# EAGLE design neo (EAGLE 7.6.0)

## Sheet 1 of 2
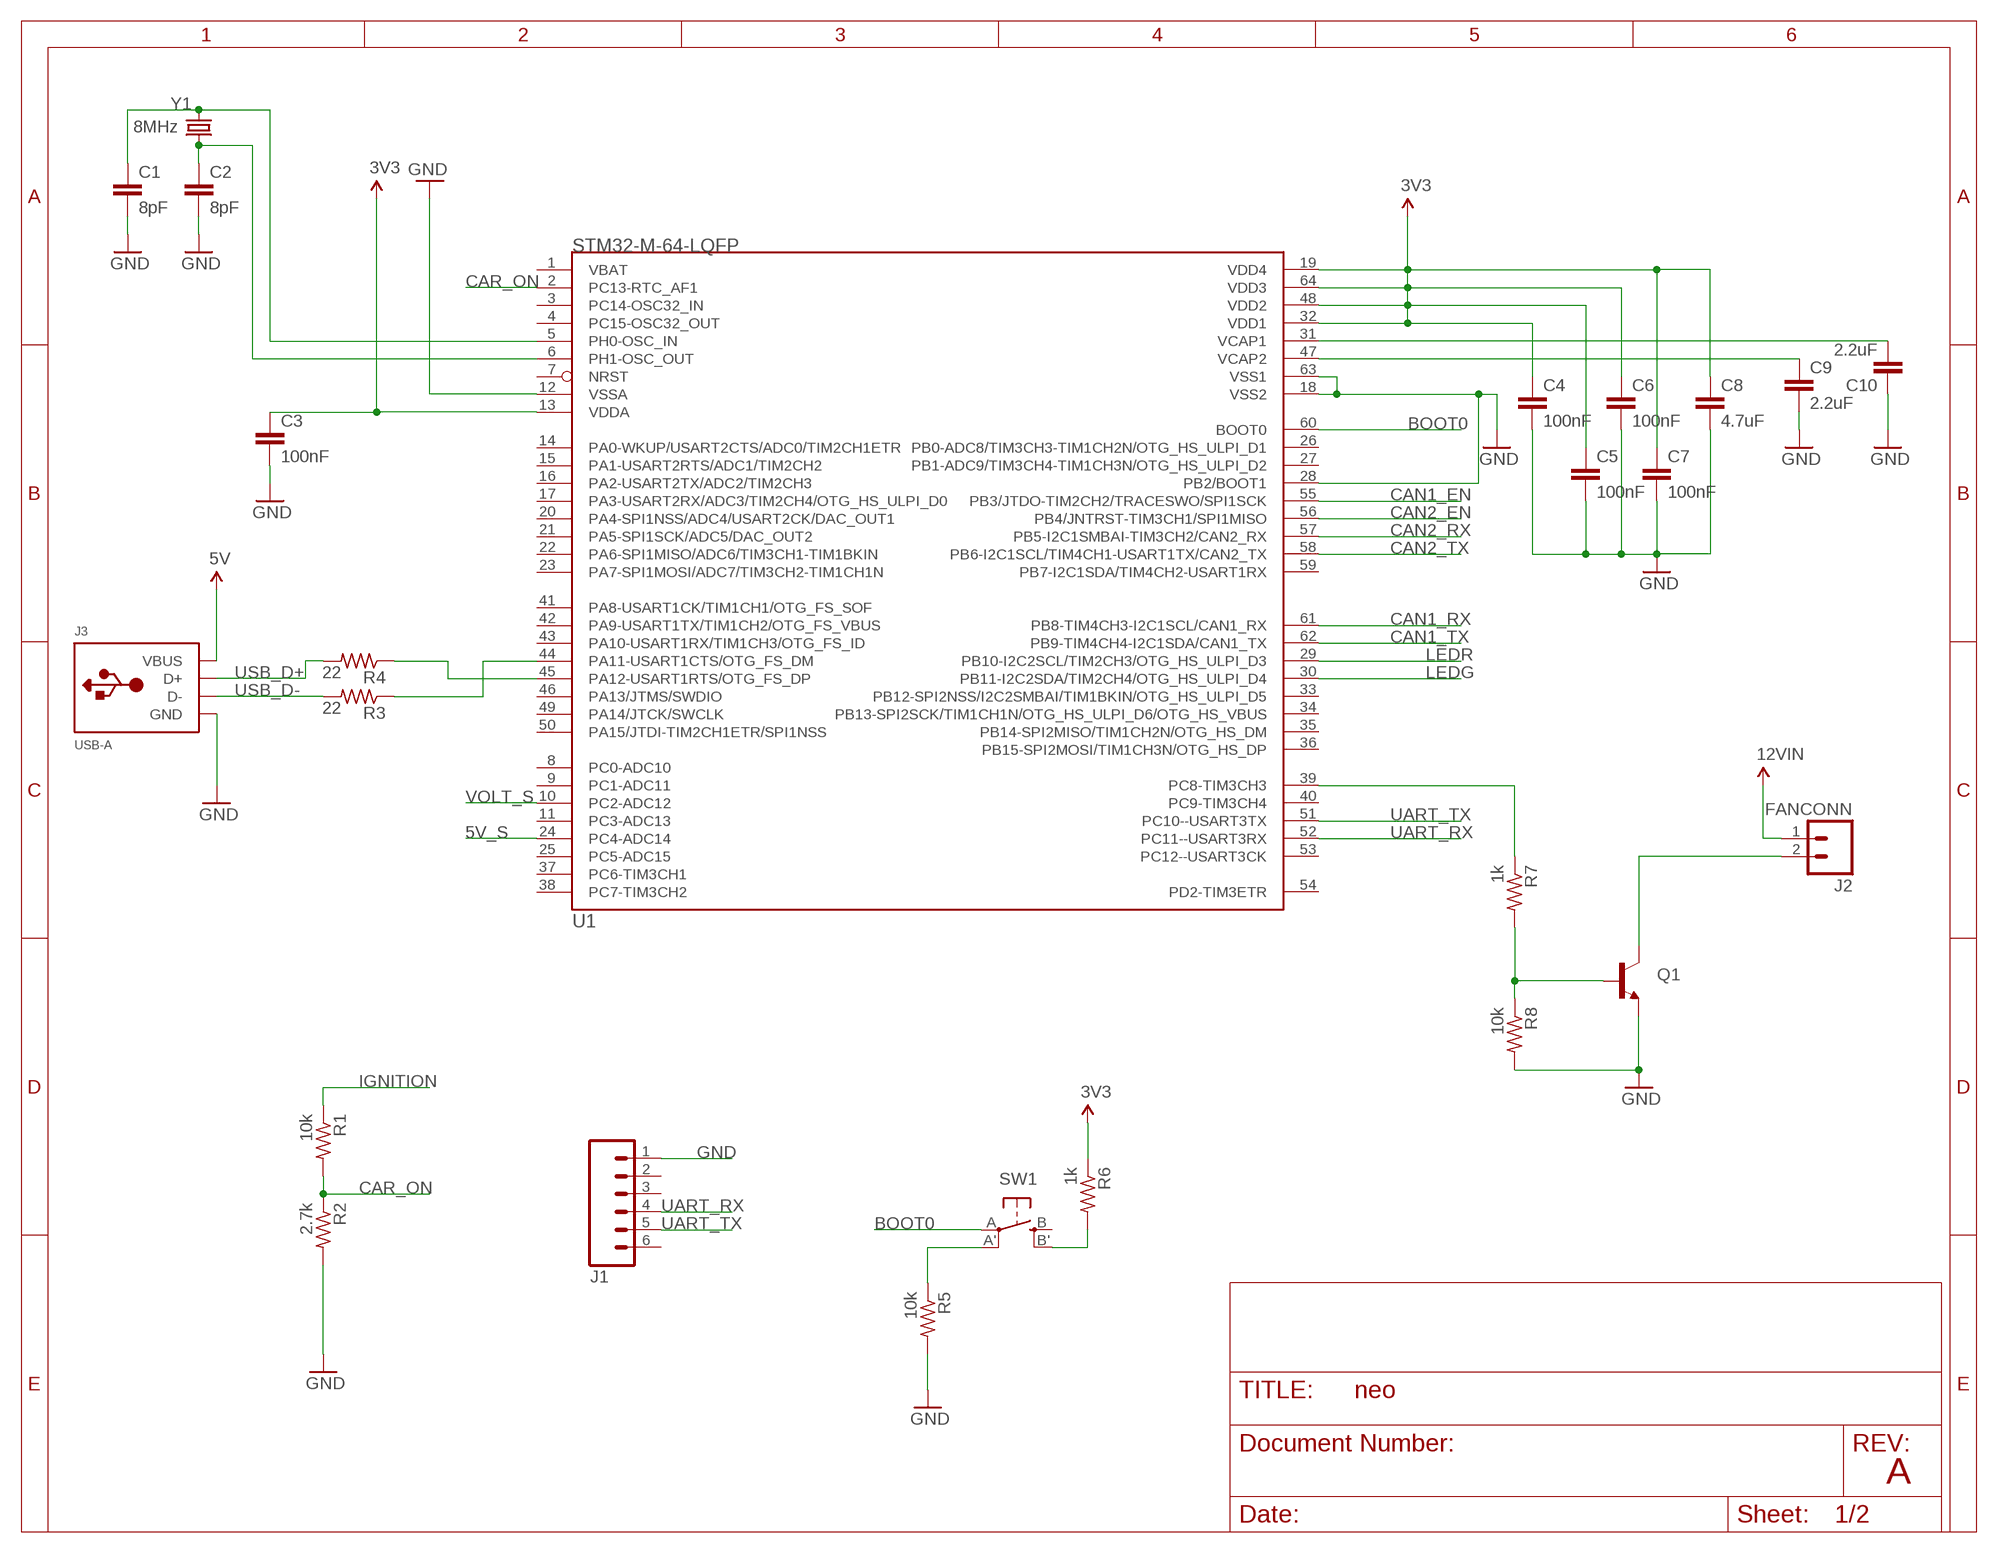
[diagram p0: schematic, sheet 1]

### Parts
C1  8pF  1.0UF-16V-10%(0603)  [0603-CAP]
C2  8pF  1.0UF-16V-10%(0603)  [0603-CAP]
C3  100nF  1.0UF-16V-10%(0603)  [0603-CAP]
C4  100nF  1.0UF-16V-10%(0603)  [0603-CAP]
C5  100nF  1.0UF-16V-10%(0603)  [0603-CAP]
C6  100nF  0.1UF-25V-5%(0603)  [0603-CAP]
C7  100nF  1.0UF-16V-10%(0603)  [0603-CAP]
C8  4.7uF  1.0UF-16V-10%(0603)  [0603-CAP]
C9  2.2uF  1.0UF-16V-10%(0603)  [0603-CAP]
C10  2.2uF  1.0UF-16V-10%(0603)  [0603-CAP]
J1  M06NO_SILK_YES_STOP  [1X06_NO_SILK_YES_STOP]
J2  FANCONN  [1.25CONN]
J3  USB-A  [MOLEX_480371000]
Q1  MMBT2222A  TRANSISTOR_NPNMMBT2222A  [SOT23-3]
R1  10k  R-US_R0603  [R0603]
R2  2.7k  R-US_R0603  [R0603]
R3  22  R-US_R0603  [R0603]
R4  22  R-US_R0603  [R0603]
R5  10k  R-US_R0603  [R0603]
R6  1k  R-US_R0603  [R0603]
R7  1k  R-US_R0603  [R0603]
R8  10k  R-US_R0603  [R0603]
SW1  SPST_TACT-EVQQ2  [EVQ-Q2]
U1  STM32-M-64-LQFP  [LQFP64]
Y1  8MHz  CRYSTALTXC-7A  [CRYSTAL-TXC-7A]

### Nets
3V3: C3.1 C4.1 C5.1 C6.1 C7.1 C8.1 R6.1 U1.13(VDDA) U1.19(VDD4) U1.32(VDD1) U1.48(VDD2) U1.64(VDD3) ; also sheet 2
5V: J3.1(VBUS) ; also sheet 2
5V_S: U1.24(PC4-ADC14) ; also sheet 2
12VIN: J2.1 ; also sheet 2
BOOT0: SW1.A(P) U1.60(BOOT0)
CAN1_EN: U1.55(PB3/JTDO-TIM2CH2/TRACESWO/SPI1SCK) ; also sheet 2
CAN1_RX: U1.61(PB8-TIM4CH3-I2C1SCL/CAN1_RX) ; also sheet 2
CAN1_TX: U1.62(PB9-TIM4CH4-I2C1SDA/CAN1_TX) ; also sheet 2
CAN2_EN: U1.56(PB4/JNTRST-TIM3CH1/SPI1MISO) ; also sheet 2
CAN2_RX: U1.57(PB5-I2C1SMBAI-TIM3CH2/CAN2_RX) ; also sheet 2
CAN2_TX: U1.58(PB6-I2C1SCL/TIM4CH1-USART1TX/CAN2_TX) ; also sheet 2
CAR_ON: R1.2 R2.1 U1.2(PC13-RTC_AF1)
FAN_PWM: R7.1 U1.39(PC8-TIM3CH3)
GND: C1.2 C2.2 C3.2 C4.2 C5.2 C6.2 C7.2 C8.2 C9.2 C10.1 J1.1 J3.4(GND) Q1.2(E) R2.2 R5.2 R8.2 U1.12(VSSA) U1.18(VSS2) U1.28(PB2/BOOT1) U1.63(VSS1) ; also sheet 2
IGNITION: R1.1 ; also sheet 2
LEDG: U1.30(PB11-I2C2SDA/TIM2CH4/OTG_HS_ULPI_D4) ; also sheet 2
LEDR: U1.29(PB10-I2C2SCL/TIM2CH3/OTG_HS_ULPI_D3) ; also sheet 2
N$1: C1.1 U1.5(PH0-OSC_IN) Y1.P$1
N$3: C2.1 U1.6(PH1-OSC_OUT) Y1.P$2
N$5: R4.1 U1.45(PA12-USART1RTS/OTG_FS_DP)
N$6: J2.2 Q1.3(C)
N$7: Q1.1(B) R7.2 R8.1
N$8: R5.1 SW1.A'(P1)
N$14: R6.2 SW1.B'(S1)
N$35: R3.1 U1.44(PA11-USART1CTS/OTG_FS_DM)
UART_RX: J1.4 U1.52(PC11--USART3RX)
UART_TX: J1.5 U1.51(PC10--USART3TX)
USB_D+: J3.3(D+) R4.2
USB_D-: J3.2(D-) R3.2
VCAP1: C10.2 U1.31(VCAP1)
VCAP2: C9.1 U1.47(VCAP2)
VOLT_S: U1.10(PC2-ADC12) ; also sheet 2
Unconnected: J1.2 J1.3 J1.6 SW1.B(S) U1.1(VBAT) U1.3(PC14-OSC32_IN) U1.4(PC15-OSC32_OUT) U1.7(NRST) U1.8(PC0-ADC10) U1.9(PC1-ADC11) U1.11(PC3-ADC13) U1.14(PA0-WKUP/USART2CTS/ADC0/TIM2CH1ETR) U1.15(PA1-USART2RTS/ADC1/TIM2CH2) U1.16(PA2-USART2TX/ADC2/TIM2CH3) U1.17(PA3-USART2RX/ADC3/TIM2CH4/OTG_HS_ULPI_D0) U1.20(PA4-SPI1NSS/ADC4/USART2CK/DAC_OUT1) U1.21(PA5-SPI1SCK/ADC5/DAC_OUT2) U1.22(PA6-SPI1MISO/ADC6/TIM3CH1-TIM1BKIN) U1.23(PA7-SPI1MOSI/ADC7/TIM3CH2-TIM1CH1N) U1.25(PC5-ADC15) U1.26(PB0-ADC8/TIM3CH3-TIM1CH2N/OTG_HS_ULPI_D1) U1.27(PB1-ADC9/TIM3CH4-TIM1CH3N/OTG_HS_ULPI_D2) U1.33(PB12-SPI2NSS/I2C2SMBAI/TIM1BKIN/OTG_HS_ULPI_D5) U1.34(PB13-SPI2SCK/TIM1CH1N/OTG_HS_ULPI_D6/OTG_HS_VBUS) U1.35(PB14-SPI2MISO/TIM1CH2N/OTG_HS_DM) U1.36(PB15-SPI2MOSI/TIM1CH3N/OTG_HS_DP) U1.37(PC6-TIM3CH1) U1.38(PC7-TIM3CH2) U1.40(PC9-TIM3CH4) U1.41(PA8-USART1CK/TIM1CH1/OTG_FS_SOF) U1.42(PA9-USART1TX/TIM1CH2/OTG_FS_VBUS) U1.43(PA10-USART1RX/TIM1CH3/OTG_FS_ID) U1.46(PA13/JTMS/SWDIO) U1.49(PA14/JTCK/SWCLK) U1.50(PA15/JTDI-TIM2CH1ETR/SPI1NSS) U1.53(PC12--USART3CK) U1.54(PD2-TIM3ETR) U1.59(PB7-I2C1SDA/TIM4CH2-USART1RX)

### Notes on the sheet
- A

## Sheet 2 of 2
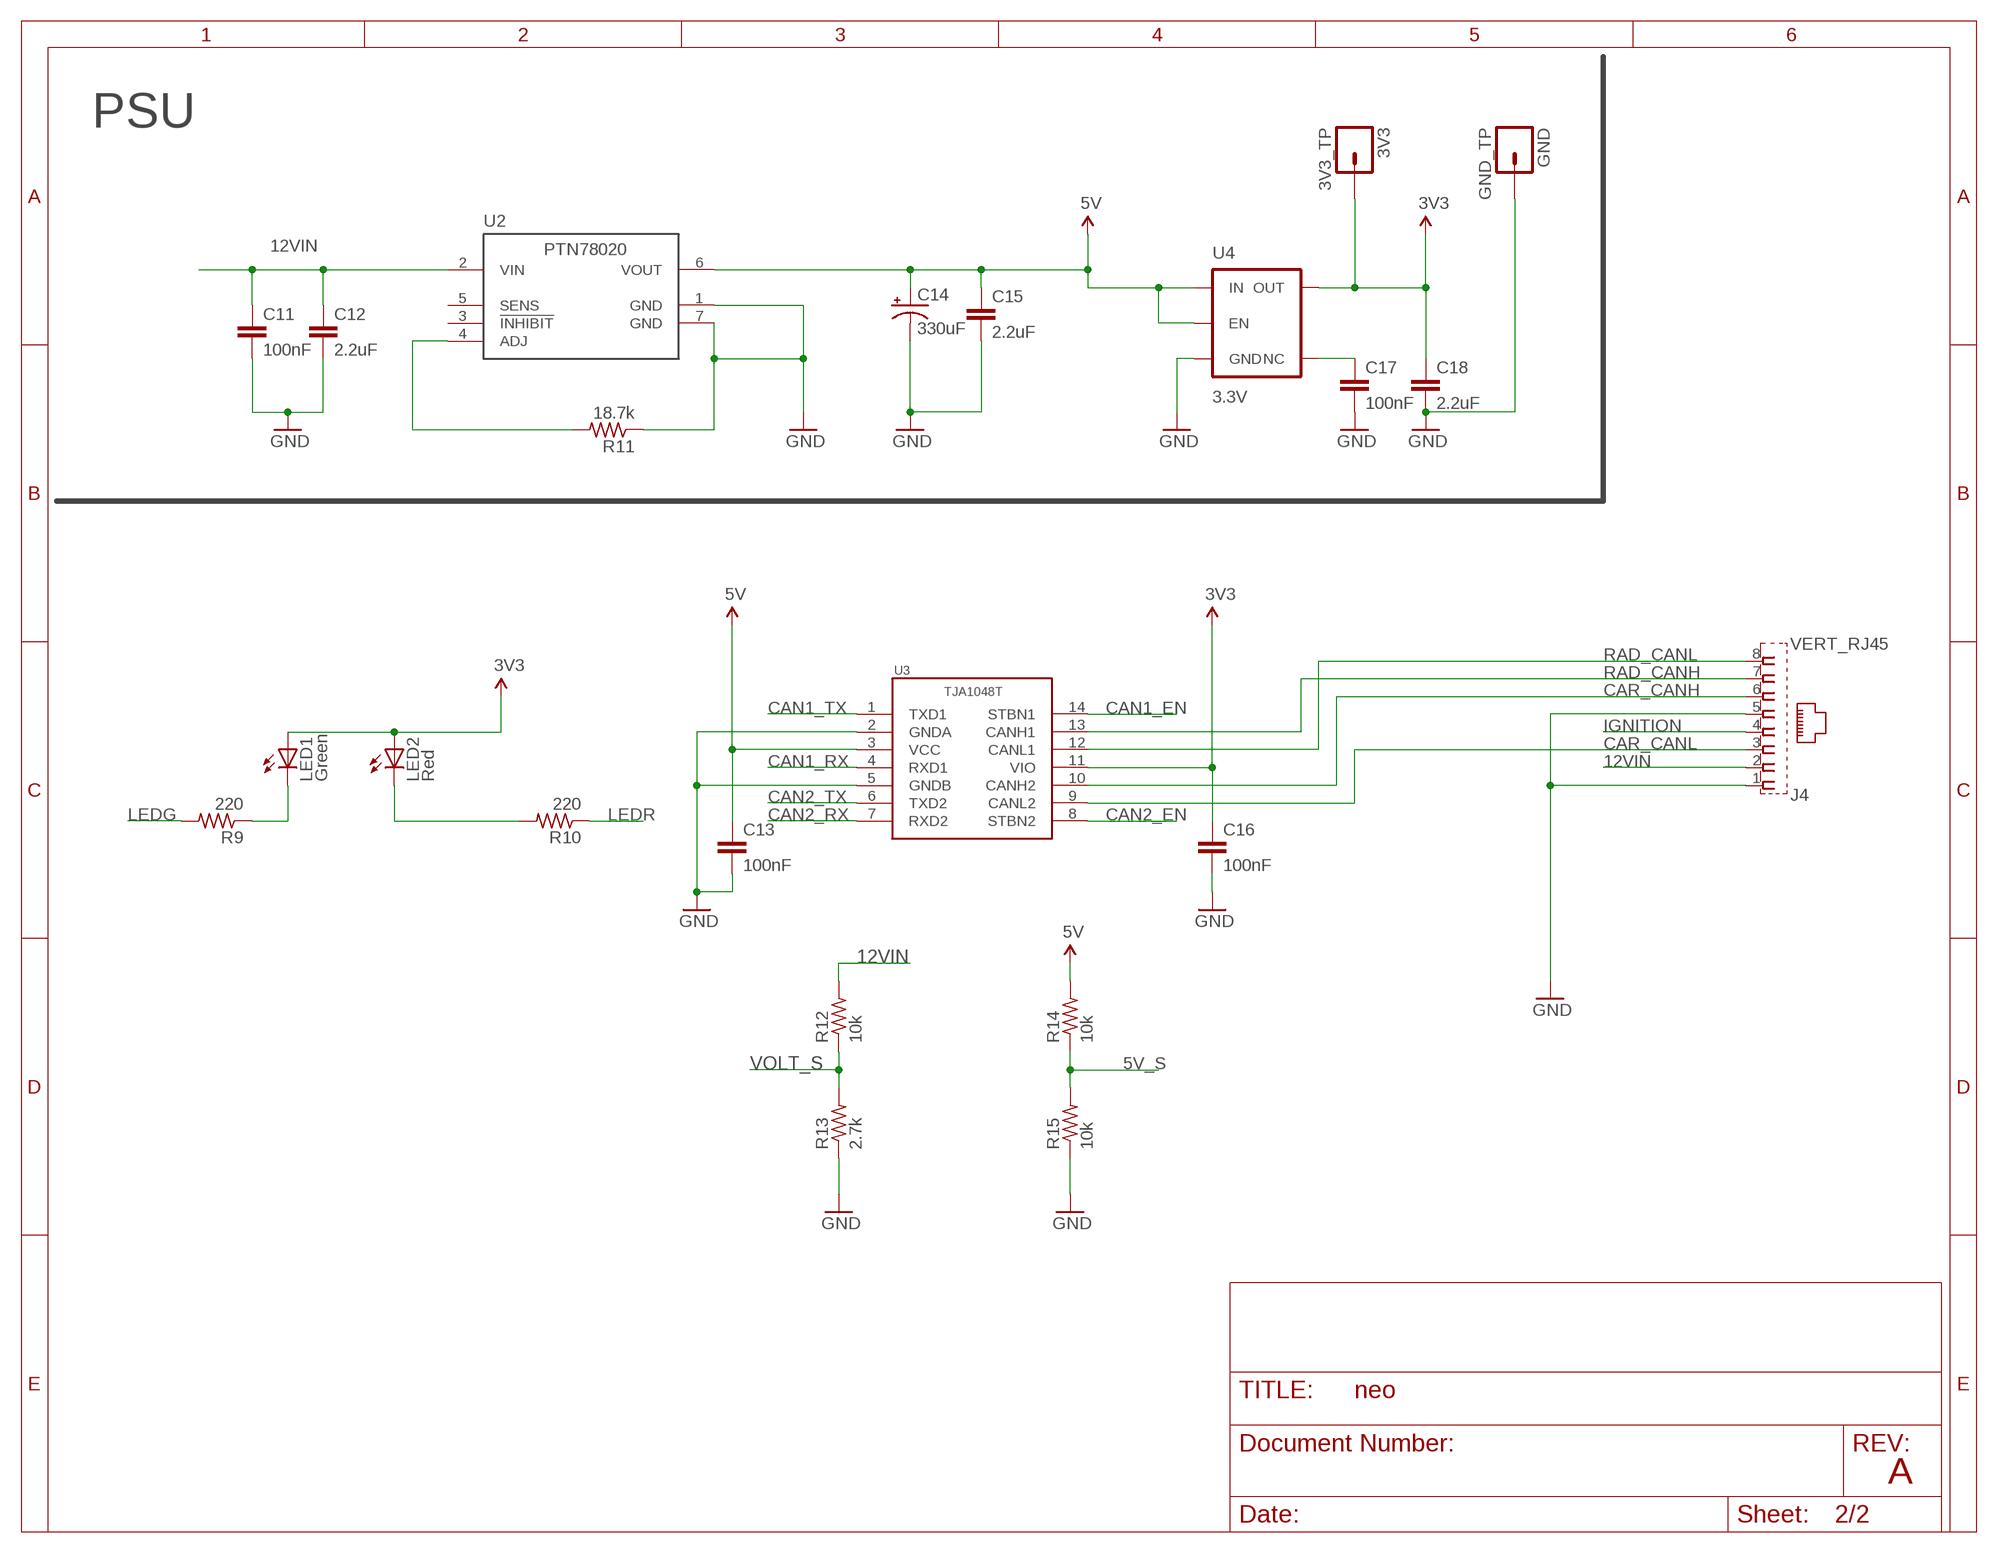
[diagram p1: schematic, sheet 2]

### Parts
3V3  3V3_TP  M01PTH_NO_SILK_YES_STOP  [1X01_NO_SILK]
C11  100nF  0.22UF-25V-10%(0603)  [0603-CAP]
C12  2.2uF  2.2UF-25V-+80/-20(0805)  [0805-CAP]
C13  100nF  CAP0603-CAP  [0603-CAP]
C14  330uF  C-POL  [E3,5-8]
C15  2.2uF  2.2UF-25V-+80/-20(0805)  [0805-CAP]
C16  100nF  CAP0603-CAP  [0603-CAP]
C17  100nF  CAP0603-CAP  [0603-CAP]
C18  2.2uF  CAP0603-CAP  [0603-CAP]
GND  GND_TP  M01PTH_NO_SILK_YES_STOP  [1X01_NO_SILK]
J4  VERT_RJ45  [GLX-S-88M]
LED1  Green  LEDCHIPLED_0805  [CHIPLED_0805]
LED2  Red  LEDCHIPLED_0805  [CHIPLED_0805]
R9  220  R-US_R0603  [R0603]
R10  220  R-US_R0603  [R0603]
R11  18.7k  R-US_R0603  [R0603]
R12  10k  R-US_R0603  [R0603]
R13  2.7k  R-US_R0603  [R0603]
R14  10k  R-US_R0603  [R0603]
R15  10k  R-US_R0603  [R0603]
U2  PTN78020W  [PTN78020W]
U3  TJA1048  [SO14]
U4  3.3V  V_REG_AP2112K-3.3V  [SOT23-5]

### Nets
3V3: 3V3.1 C16.1 C18.1 LED1.A LED2.A U3.11(VIO) U4.5(OUT) ; also sheet 1
5V: C13.1 C14.+ C15.1 R14.2 U2.6(VOUT) U3.3(VCC) U4.1(IN) U4.3(EN) ; also sheet 1
5V_S: R14.1 R15.2 ; also sheet 1
12VIN: C11.1 C12.1 J4.2 R12.2 U2.2(VIN) ; also sheet 1
CAN1_EN: U3.14(STBN1) ; also sheet 1
CAN1_RX: U3.4(RXD1) ; also sheet 1
CAN1_TX: U3.1(TXD1) ; also sheet 1
CAN2_EN: U3.8(STBN2) ; also sheet 1
CAN2_RX: U3.7(RXD2) ; also sheet 1
CAN2_TX: U3.6(TXD2) ; also sheet 1
CAR_CANH: J4.6 U3.10(CANH2)
CAR_CANL: J4.3 U3.9(CANL2)
GND: C11.2 C12.2 C13.2 C14.- C15.2 C16.2 C17.2 C18.2 GND.1 J4.1 J4.5 R11.1 R13.1 R15.1 U2.1(GND) U2.7(GND) U3.2(GNDA) U3.5(GNDB) U4.2(GND) ; also sheet 1
IGNITION: J4.4 ; also sheet 1
LEDG: R9.2 ; also sheet 1
LEDR: R10.1 ; also sheet 1
N$12: LED2.C R10.2
N$13: LED1.C R9.1
N$24: R11.2 U2.4(ADJ)
N$29: C17.1 U4.4(NC)
RAD_CANH: J4.7 U3.13(CANH1)
RAD_CANL: J4.8 U3.12(CANL1)
VOLT_S: R12.1 R13.2 ; also sheet 1
Unconnected: U2.3(!INHIBIT) U2.5(SENS)

### Notes on the sheet
- PSU
- A

## Library data of the parts
3V3 GND = SparkFun-Connectors:M01: Header 1 Standard 1-pin 0.1" header. Use with straight break away headers (SKU : PRT-00116), right angle break away headers (PRT-00553), swiss pins (PRT-00743), machine pins (PRT-00117), and female headers (PRT-00115). SMTSO-256-ET is a "flush mount" nut for a 4-40 screw. The older package used to be too tight, and did not allow it to sit properly thru the drill hit. The latest (0.165DIA) fits nice and snug.
C1-C5 C7-C10 = SparkFun-Capacitors:1.0UF-16V-10%(0603): CAP-00868; PROD_ID: CAP-00868; VALUE: 1.0uF
C6 = SparkFun-Capacitors:0.1UF-25V-5%(0603): CAP-08604; PROD_ID: CAP-08604; VALUE: 0.1uF
C11 = SparkFun-Capacitors:0.22UF-25V-10%(0603): CAP-07822; PROD_ID: CAP-07822; VALUE: 0.22uF
C12 C15 = SparkFun-Capacitors:2.2UF-25V-+80/-20(0805): CAP-11624; PROD_ID: CAP-11624
C13 C16-C18 = SparkFun-Capacitors:CAP: Capacitor Standard 0603 ceramic capacitor, and 0.1" leaded capacitor.
C14 = comma.ai:C-POL
J1 = SparkFun-Connectors:M06: Header 6 Standard 6-pin 0.1" header. Use with straight break away headers (SKU : PRT-00116), right angle break away headers (PRT-00553), swiss pins (PRT-00743), machine pins (PRT-00117), and female headers (PRT-00115). Molex polarized connector foot print use with SKU : PRT-08094 with associated crimp pins and housings. NOTES ON THE VARIANTS LOCK and LOCK_LONGPADS... This footprint was designed to help hold the alignment of a through-hole component (i.e. 6-pin header) while soldering it into place. You may notice that each hole has been shifted either up or down by 0.005 of an inch from it's more standard position (which is a perfectly straight line). This slight alteration caused the pins (the squares in the middle) to touch the edges of the holes. Because they are alternating, it causes a "brace" to hold the component in place. 0.005 has proven to be the perfect amount of "off-center" position when using our standard breakaway headers. Although looks a little odd when you look at the bare footprint, once you have a header in there, the alteration is very hard to notice. Also,if you push a header all the way into place, it is covered up entirely on the bottom side. This idea of altering the position of holes to aid alignment will be further integrated into the Sparkfun Library for other footprints. It can help hold any component with 3 or more connection pins.
J2 = comma.ai:FANCONN
J3 = adafruit:USB-A: USB type A 'plug' Used for things that can directly connect to a USB port, say USB key
J4 = comma.ai:VERT_RJ45: Mod. Jack, Right Angle, 8 posiotion, 8 contatcs RJ45 Source: GLX-S-88M.pdf; OC_FARNELL: unknown; OC_NEWARK: unknown
LED1 LED2 = adafruit:LED: LED OSRAM: - CHIPLED LG R971, LG N971, LY N971, LG Q971, LY Q971, LO R971, LY R971 LH N974, LH R974 LS Q976, LO Q976, LY Q976 LO Q996 - Hyper CHIPLED LW Q18S LB Q993, LB Q99A, LB R99A - SideLED LS A670, LO A670, LY A670, LG A670, LP A670 LB A673, LV A673, LT A673, LW A673 LH A674 LY A675 LS A676, LA A676, LO A676, LY A676, LW A676 LS A679, LY A679, LG A679 - Hyper Micro SIDELED® LS Y876, LA Y876, LO Y876, LY Y876 LT Y87S - SmartLED LW L88C, LW L88S LB L89C, LB L89S, LG L890 LS L89K, LO L89K, LY L89K LS L896, LA L896, LO L896, LY L896 - TOPLED LS T670, LO T670, LY T670, LG T670, LP T670 LSG T670, LSP T670, LSY T670, LOP T670, LYG T670 LG T671, LOG T671, LSG T671 LB T673, LV T673, LT T673, LW T673 LH T674 LS T676, LA T676, LO T676, LY T676, LB T676, LH T676, LSB T676, LW T676 LB T67C, LV T67C, LT T67C, LS T67K, LO T67K, LY T67K, LW E67C LS E67B, LA E67B, LO E67B, LY E67B, LB E67C, LV E67C, LT E67C LW T67C LS T679, LY T679, LG T679 LS T770, LO T770, LY T770, LG T770, LP T770 LB T773, LV T773, LT T773, LW T773 LH T774 LS E675, LA E675, LY E675, LS T675 LS T776, LA T776, LO T776, LY T776, LB T776 LHGB T686 LT T68C, LB T68C - Hyper Mini TOPLED® LB M676 - Mini TOPLED Santana® LG M470 LS M47K, LO M47K, LY M47K Source: http://www.osram.convergy.de/
Q1 = SparkFun-DiscreteSemi:TRANSISTOR_NPN: Generic NPN BJT MMBT2222A - TRANS-08049 (SOT-23, 1A 40V) MPSA42 - TRANS-09116 (SOT-23, 500mA 300V) MMBT5088LT1G - TRANS-11160 (SOT-23, 50 mA 30V) BC547 - COM-08928 <http://www.sparkfun.com/products/8928> (TO-92 45V 100mA) (1.Collector 2.Base 3.Emitter) 2N3904 - COM-00521 <http://www.sparkfun.com/products/521> (TO-92 40V 200mA) (1.Emitter 2.Base 3.Collector) P2N2222A - COM-12852 <http://www.sparkfun.com/products/12852> (TO-92 40V 600mA) (1.Collector 2.Base 3.Emitter); PROD_ID: TRANS-08049
R1-R15 = adafruit:R-US_: RESISTOR, American symbol
SW1 = adafruit:SPST_TACT: SMT 6mm switch, EVQQ2 series http://www.ladyada.net/library/eagle
U1 = comma.ai:STM32-M-64-LQFP: STM32F103 Medium Density 64pin LQFP
U2 = comma.ai:PTN78020W
U3 = comma.ai:TJA1048
U4 = SparkFun-PowerIC:V_REG_AP2112: AP2112 - 600mA CMOS LDO Regulator w/ Enable The AP2112 is CMOS process low dropout linear regulator with enable function, the regulator delivers a guaranteed 600mA (min.) continuous load current. Features Output Voltage Accuracy: ±1.5% Output Current: 600mA (Min.) Foldback Short Current Protection: 50mA Enable Function to Turn ON/OFF VOUT Low Dropout Voltage (3.3V): 250mV (Typ.) @IOUT=600mA Excellent Load Regulation: 0.2%/A (Typ.) Excellent Line Regulation: 0.02%/V (Typ.) Low Quiescent Current: 55μA (Typ.) Low Standby Current: 0.01μA (Typ.) Low Output Noise: 50μVRMS PSRR: 100Hz -65dB, 1kHz -65dB OTSD Protection Stable with 1.0μF Flexible Cap: Ceramic, Tantalum and Aluminum Electrolytic Operation Temperature Range: -40°C to 85°C ESD: MM 400V, HBM 4000V; PROD_ID: VREG-12457
Y1 = SparkFun-FreqCtrl:CRYSTAL: Various standard crystals. Proven footprints.

## Board
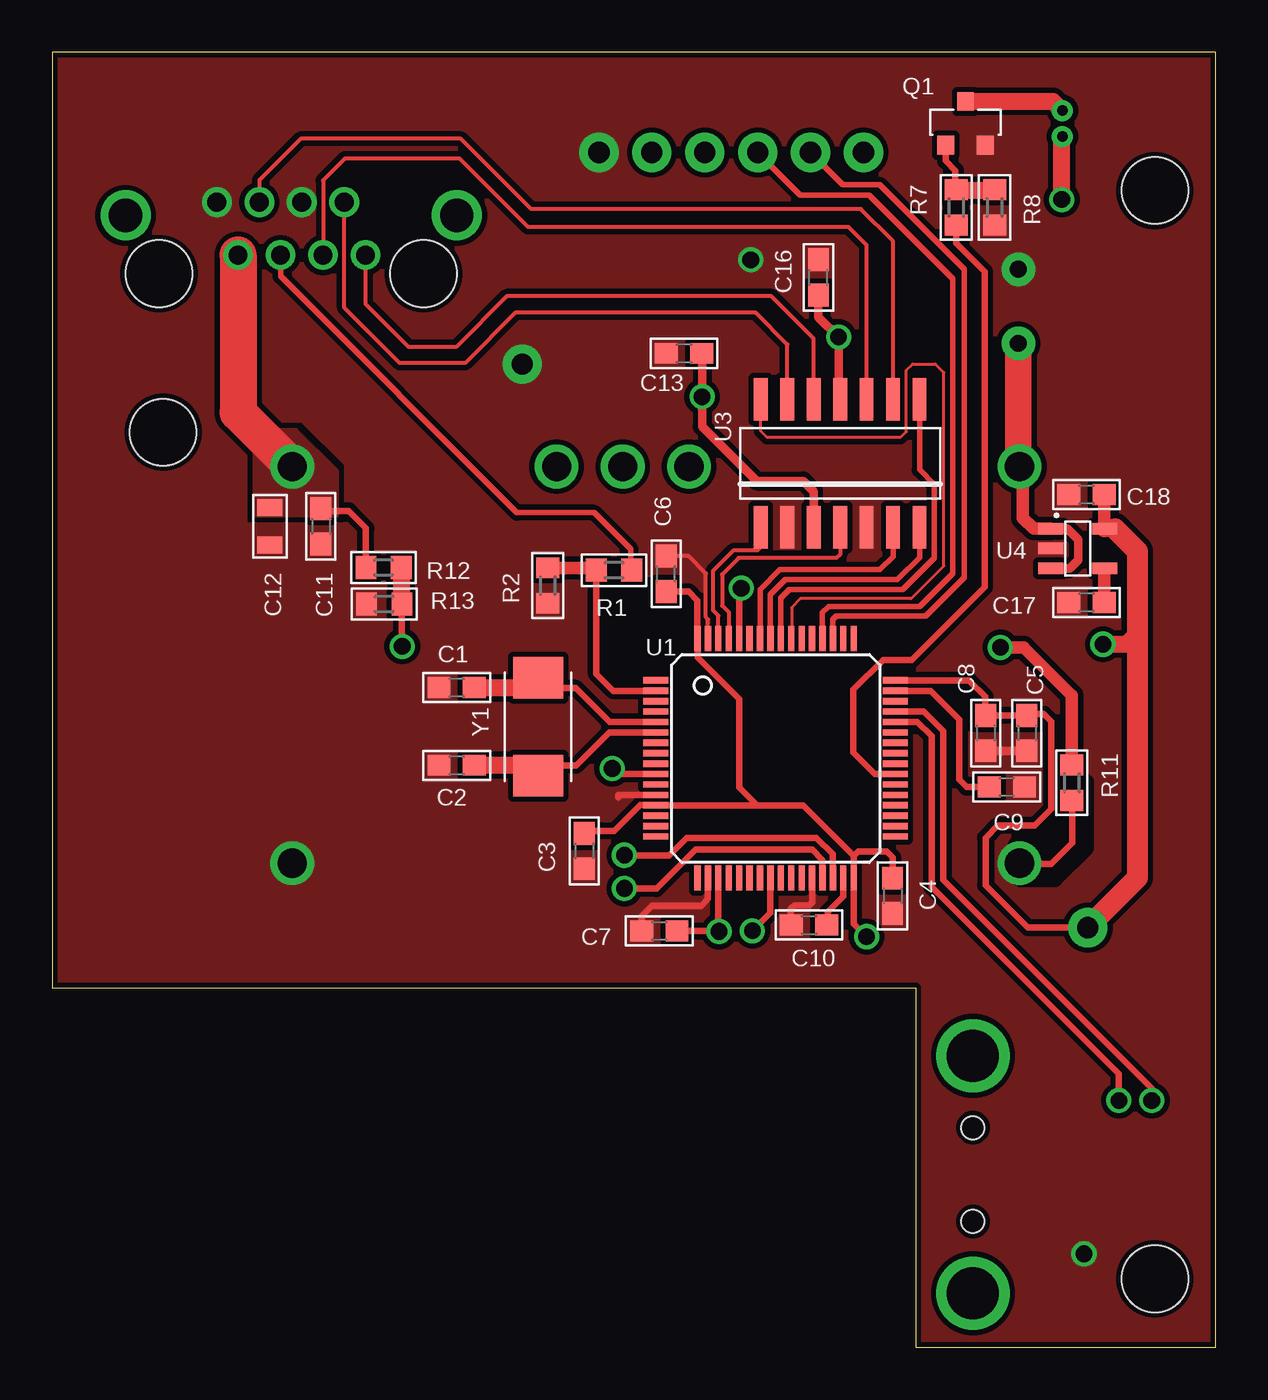
[diagram p2: board, top side]
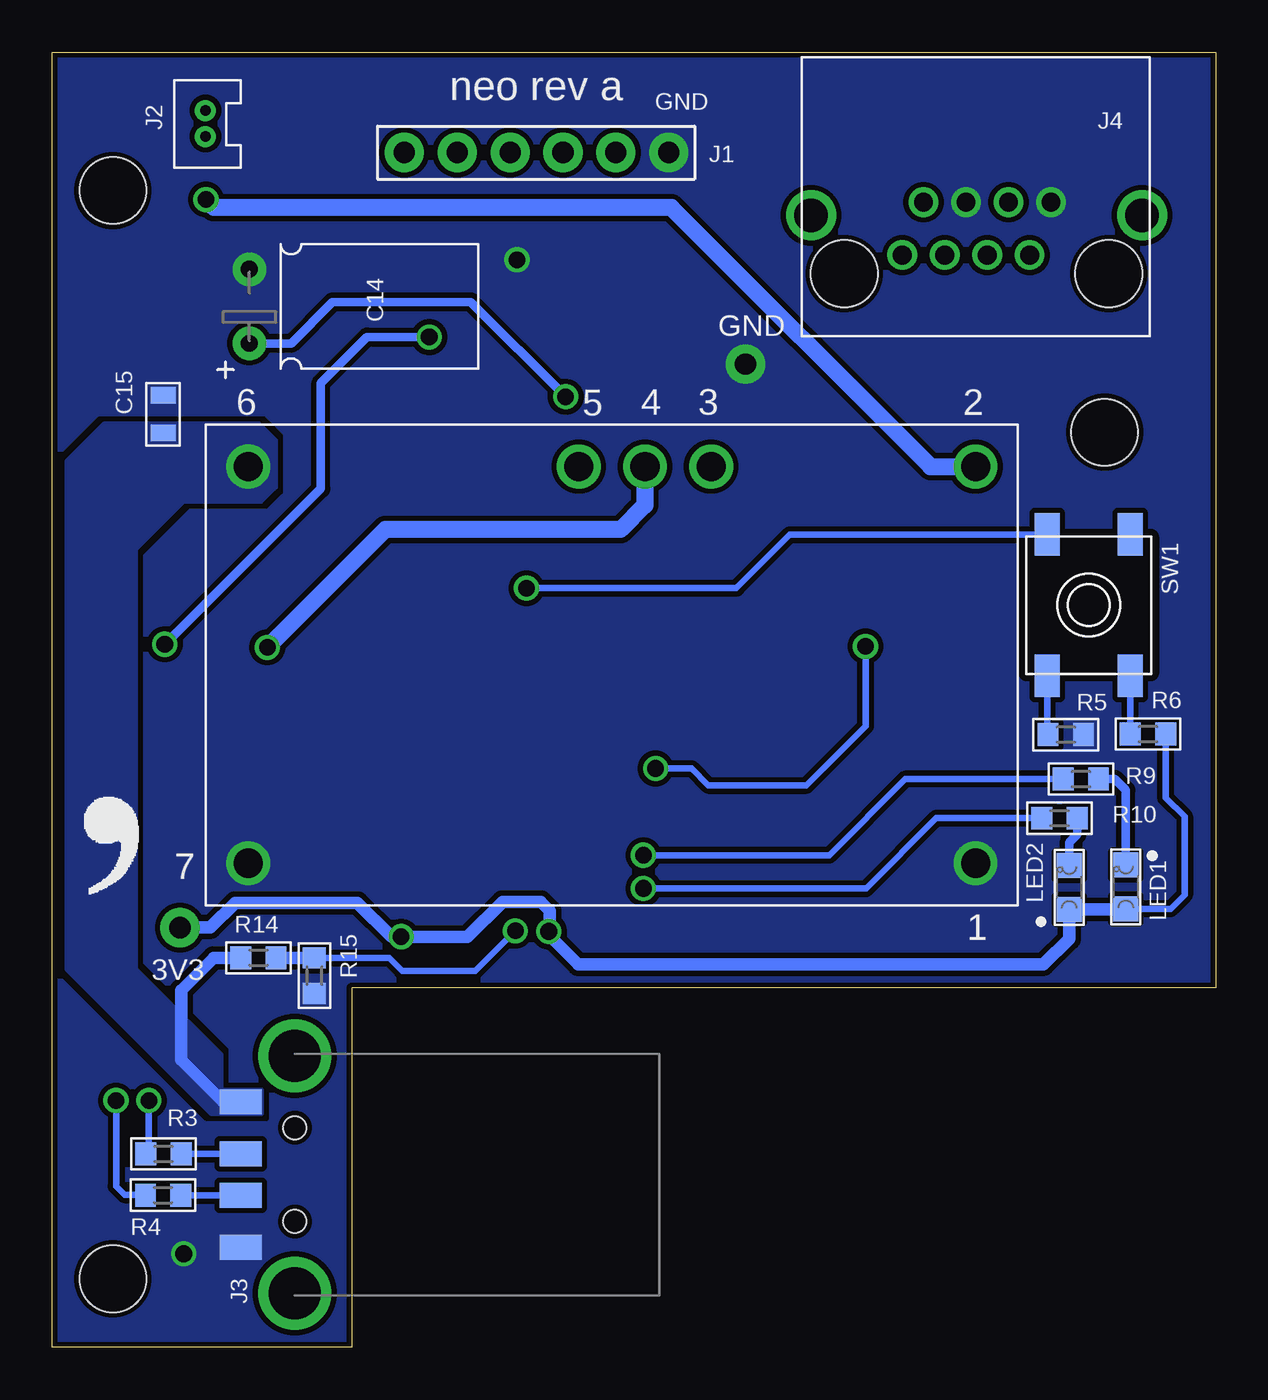
[diagram p3: board, bottom side, seen from below]

Size 55.88 x 62.23 mm. Coordinates in mm from the lower left corner, seen from the top.
Outline: 0,62.23 0,17.27 41.48,17.27 41.48,0 55.88,0 55.88,62.23 0,62.23
Copper layers (1*16): Top 0.035mm / dielectric 1.5mm / Bottom 0.035mm
Design rules "default *": minimum track width 6mil, minimum drill 24mil, track to track 6mil, track to pad 6mil, pad to pad 6mil, via to via 6mil, smd to smd 6mil, copper to edge 10mil, drill to drill 6mil, minimum pad ring 10mil, minimum via ring 8mil, stop-mask expansion 4mil, vias tented up to drill 0mil, thermal gap 10mil
Holes 3.2 mm at 52.96,55.58 52.96,3.3 5.33,43.97
tRestrict: area 46.3,22.5 to 49.7,27.2
bRestrict: area 3.1,32.4 to 9.1,39

### Footprints (pad centres in the part's own frame; a part is rotated, then mirrored left to right if it is on the bottom)
1X01_NO_SILK = drill 1.016 pad 1.88: 1 0,0
0603-CAP = smd 1.1 x 1: 1 -0.85,0; 2 0.85,0
0805-CAP = smd 0.8 x 1.2: 1 -0.9,0; 2 0.9,0
E3,5-8 = drill 0.813 pad 1.6: + -1.778,0; - 1.778,0
1X06_NO_SILK_YES_STOP = drill 1.016 pad 1.88: 1 0,0; 2 2.54,0; 3 5.08,0; 4 7.62,0; 5 10.16,0; 6 12.7,0
1.25CONN = drill 0.5: 1 0,0; 2 1.25,0
MOLEX_480371000 = smd 1.2 x 2: 1 3.5,2.6; 2 1,2.6; 3 -1,2.6; 4 -3.5,2.6 | drill 2.5: M1 -5.7,0; M2 5.7,0 | hole 1.1: -2.25,0; 2.25,0
GLX-S-88M = drill 0.9 pad 1.422: 1 -4.66,-3.43; 2 -3.64,-0.89; 3 -2.62,-3.43; 4 -1.6,-0.89; 5 -0.58,-3.43; 6 0.44,-0.89; 7 1.46,-3.43; 8 2.48,-0.89 | drill 1.6 pad 2.184: S1 -9.04,-2.8; S2 6.86,-2.8 | hole 3.2: -7.44,0; 5.26,0
CHIPLED_0805 = smd 1.2 x 1.2: A 0,-1.05; C 0,1.05
SOT23-3 = smd 0.8 x 0.9: 1 -0.95,-1; 2 0.95,-1; 3 0,1.1
R0603 = smd 1 x 1.1: 1 -0.85,0; 2 0.85,0
EVQ-Q2 = smd 2.032 x 1.2: A -3.4,-2; A' 3.4,-2; B -3.4,2; B' 3.4,2
LQFP64 = smd 1.2 x 0.3: 1 -5.75,3.75; 2 -5.75,3.25; 3 -5.75,2.75; 4 -5.75,2.25; 5 -5.75,1.75; 6 -5.75,1.25; 7 -5.75,0.75; 8 -5.75,0.25; 9 -5.75,-0.25; 10 -5.75,-0.75; 11 -5.75,-1.25; 12 -5.75,-1.75; 13 -5.75,-2.25; 14 -5.75,-2.75; 15 -5.75,-3.25; 16 -5.75,-3.75; 33 5.75,-3.75; 34 5.75,-3.25; 35 5.75,-2.75; 36 5.75,-2.25; 37 5.75,-1.75; 38 5.75,-1.25; 39 5.75,-0.75; 40 5.75,-0.25; 41 5.75,0.25; 42 5.75,0.75; 43 5.75,1.25; 44 5.75,1.75; 45 5.75,2.25; 46 5.75,2.75; 47 5.75,3.25; 48 5.75,3.75 | smd 0.3 x 1.2: 17 -3.75,-5.75; 18 -3.25,-5.75; 19 -2.75,-5.75; 20 -2.25,-5.75; 21 -1.75,-5.75; 22 -1.25,-5.75; 23 -0.75,-5.75; 24 -0.25,-5.75; 25 0.25,-5.75; 26 0.75,-5.75; 27 1.25,-5.75; 28 1.75,-5.75; 29 2.25,-5.75; 30 2.75,-5.75; 31 3.25,-5.75; 32 3.75,-5.75; 49 3.75,5.75; 50 3.25,5.75; 51 2.75,5.75; 52 2.25,5.75; 53 1.75,5.75; 54 1.25,5.75; 55 0.75,5.75; 56 0.25,5.75; 57 -0.25,5.75; 58 -0.75,5.75; 59 -1.25,5.75; 60 -1.75,5.75; 61 -2.25,5.75; 62 -2.75,5.75; 63 -3.25,5.75; 64 -3.75,5.75
PTN78020W = drill 1.4: 1 2.03,-2.03; 2 2.03,-21.08; 3 14.73,-21.08; 4 17.91,-21.08; 5 21.09,-21.08; 6 36.96,-21.08; 7 36.96,-2.03
SO14 = smd 0.66 x 2.032: 1 -3.81,-3.073; 2 -2.54,-3.073; 3 -1.27,-3.073; 4 0,-3.073; 5 1.27,-3.073; 6 2.54,-3.073; 7 3.81,-3.073; 8 3.81,3.073; 9 2.54,3.073; 10 1.27,3.073; 11 0,3.073; 12 -1.27,3.073; 13 -2.54,3.073; 14 -3.81,3.073
SOT23-5 = smd 0.55 x 1.2: 1 -0.95,-1.3; 2 0,-1.3; 3 0.95,-1.3; 4 0.95,1.3; 5 -0.95,1.3
CRYSTAL-TXC-7A = smd 2 x 2.4: P$1 2.35,0; P$2 -2.35,0

### Placement (x,y rotation side)
3V3  49.73,20.17 180 top
C1  19.43,31.7 180 top
C2  19.43,27.97 180 top
C3  25.55,23.85 270 top
C4  40.36,21.69 270 top
C5  46.81,29.51 270 top
C6  29.49,37.16 90 top
C7  29.16,20 180 top
C8  44.83,29.51 270 top
C9  45.85,26.92 0 top
C10  36.35,20.29 0 top
C11  12.9,39.45 270 top
C12  10.46,39.45 270 top
C13  30.35,47.75 180 top
C14  46.41,50.01 90 bottom
C15  50.55,44.83 90 bottom
C16  36.8,51.41 90 top
C17  49.68,35.79 180 top
C18  49.68,40.97 180 top
GND  22.58,47.24 0 top
J1  26.26,57.4 180 bottom
J2  48.51,58.17 90 bottom
J3  44.22,8.31 90 bottom
J4  12.57,51.59 180 bottom
LED1  4.32,22.12 0 bottom
LED2  7.04,22.1 0 bottom
Q1  43.87,58.75 0 top
R1  26.99,37.34 180 top
R2  23.8,36.6 270 top
R3  50.53,9.3 0 bottom
R4  50.55,7.32 0 bottom
R5  7.2,29.44 0 bottom
R6  3.25,29.46 180 bottom
R7  43.42,54.76 90 top
R8  45.26,54.76 270 top
R9  6.48,27.3 180 bottom
R10  7.51,25.43 0 bottom
R11  48.97,27.13 90 top
R12  15.93,37.46 180 top
R13  15.95,35.71 0 top
R14  45.97,18.72 180 bottom
R15  43.28,17.86 90 bottom
SW1  6.1,35.66 270 bottom
U1  34.75,28.3 0 top
U2  9.5,21.23 180 bottom
U3  37.85,42.47 0 top
U4  49.25,38.38 270 top
U$1  [LOGO]  54.99,21.46 0 bottom
Y1  23.34,29.82 90 top

### Tracks (layer width: path | path; a pad name or v marks a point on that pad's centre or on a via)
3V3  (via drill 0.8)
  Top 0.305: U1.48 44.03,32.05 44.81,31.27 44.81,30.38 C8.1 C5.1 47.04,30.59 47.2,30.43 47.62,30.43 47.98,30.07 47.98,25.86 47.19,25.07 45.42,25.07 44.83,24.49 44.83,22.2 46.86,20.17 3V3.1 | 38.5,23.61 U1.32 38.5,20.36 v39.12,19.74 | 38.5,23.61 38.71,23.83 40.08,23.83 40.36,23.55 C4.1 | C7.1 32.02,20 v32.03,19.99 32,20.02 U1.19 | 33.86,26.05 U1.13 28.98,26.06 28.25,26.06 27,24.82 25.77,24.82 C3.1 | 33.86,26.05 36.06,26.05 38.5,23.61 | 33.86,26.05 33,26.91 33,31.14 31,33.14 U1.64 30.99,34.05 30.99,35.89 30.57,36.31 C6.1
  Top 0.406: 37.87,45.57 U3.11 37.77,45.62 v37.77,48.54 36.8,49.5 C16.1
  Top 0.61: C18.1 50.53,39.35 U4.5
  Top 0.813: 51.04,39.33 U4.5 | v50.47,33.78 51.61,33.78 52.12,34.29
  Top 1.016: 51.04,39.33 52.12,38.25 52.12,34.29 52.12,22.55 3V3.1
  Bottom 0.305: 31.98,20.04 v32.03,19.99 | LED1.A 2.17,21.07 1.5,21.74 1.5,25.5 2.4,26.4 R6.1
  Bottom 0.406: 50.44,33.78 50.5,33.73 | v50.47,33.78 50.44,33.78 | 37.77,48.49 v37.77,48.54 40.77,48.54 42.98,46.33 42.98,41.25 50.44,33.78
  Bottom 0.61: 31.98,20.04 31.98,20.98 32.41,21.41 34.24,21.41 35.94,19.71 39.12,19.71 v39.12,19.74 39.6,19.74 41.22,21.36 47.09,21.36 48.28,20.17 3V3.1 | v32.03,19.99 32.03,19.81 30.61,18.39 8.28,18.39 7.04,19.63 LED2.A 4.34,21.05 LED1.A
5V  (via drill 0.8)
  Top 0.406: U4.1 48.76,39.33 49.28,38.81 49.28,37.82 48.87,37.41 47.97,37.41 U4.3 | U3.3 36.58,41.12 36.07,41.63 33.83,41.63 31.22,44.25 v31.22,45.67 | 31.22,45.54 v31.22,45.67 | 31.2,45.68 v31.22,45.67 | C13.1 31.22,47.74 v31.22,45.67
  Top 0.61: U4.1 47.13,39.33 46.61,39.85 46.61,42.16 U2.6
  Top 1.27: C14.+ 46.41,42.37 U2.6
  Bottom 0.406: v31.22,45.67 35.76,50.22 42.42,50.22 44.4,48.23 C14.+
  Bottom 0.61: J3.1 47.67,11.81 49.68,13.82 49.68,17.14 48.11,18.72 R14.2
  pour Bottom (no thermals): 45.14,43.59 45.14,41.33 45.85,40.61 49.58,40.61 51.87,38.33 51.87,18.19 47.75,14.07 47.75,12.4 45.82,12.4 45.82,11.2 47.8,11.2 48.23,11.2 55.17,18.14 55.17,42.6 53.37,44.4 45.95,44.4
5V_S  (via drill 0.8)
  Top 0.305: v33.63,20.02 34.5,20.88 U1.24
  Bottom 0.305: R15.2 39.69,18.71 39.06,18.09 35.56,18.09 v33.63,20.02
  Bottom 0.61: R14.1 43.3,18.72 R15.2
12VIN  (via drill 0.8)
  Top 0.305: R12.2 15.08,39.36 14.25,40.18 13.07,40.18 C11.1
  Top 0.813: v48.49,55.14 48.49,58.14 J2.1
  Top 1.778: J4.2 8.93,44.91 U2.2
  Bottom 0.813: v48.49,55.14 48.11,54.76 26.14,54.76 13.69,42.31 U2.2
  pour Top (no thermals): 9.68,43.21 9.68,39.95 13.72,39.95 13.72,42.11 11.73,44.09 10.57,44.09
BOOT0  (via drill 0.8)
  Top 0.305: U1.60 33,36.38 v33.1,36.47
  Bottom 0.305: v33.1,36.47 23.01,36.47 20.45,39.04 8.12,39.04 SW1.A
CAN1_EN
  Top 0.152: U1.55 35.51,35.53 35.94,35.97 41.25,35.97 42.82,37.54 42.82,46.84 42.42,47.24 41.33,47.24 41.02,46.94 41.02,43.99 40.74,43.71 34.34,43.71 34.04,44.02 U3.14
CAN1_RX
  Top 0.203: U3.4 37.85,38.1 37.67,37.92 32.97,37.92 32.18,37.13 32.18,35.64 32.49,35.33 32.49,34.06
  Top 0.254: 32.49,34.06 U1.61
CAN1_TX
  Top 0.203: U1.62 32,35.16 31.75,35.41 31.75,37.31 32.74,38.3 33.88,38.3 34.09,38.51 34.09,39.34 U3.1
CAN2_EN
  Top 0.254: U3.8 41.66,42.16 42.37,41.45 42.37,37.92 40.84,36.4 35.41,36.4 35,35.99 U1.56
CAN2_RX
  Top 0.254: U1.57 34.5,36.17 35.2,36.88 40.59,36.88 41.66,37.95 U3.7
CAN2_TX
  Top 0.254: U1.58 34,36.41 34.95,37.36 39.75,37.36 40.39,38 U3.6
CAR_CANH
  Top 0.203: U3.10 39.12,52.96 38.25,53.82 22.86,53.82 19.56,57.12 14.07,57.12 13.01,56.07 J4.6
CAR_CANL
  Top 0.203: U3.9 40.39,53.14 38.84,54.69 23.01,54.69 19.63,58.06 11.94,58.06 9.95,56.08 J4.3
CAR_ON
  Top 0.305: U1.2 26.95,31.55 26.14,32.36 R1.2
  Top 0.61: R2.1 26.02,37.45 R1.2
FAN_PWM
  Top 0.305: U1.39 39.51,27.55 38.48,28.57 38.48,31.6 39.9,33.02 41.28,33.02 44.78,36.52 44.78,51.69 43.41,53.06 R7.1
GND  (via drill 0.8)
  Top 0.203: U1.63 31.5,34.98 31.39,35.08 31.39,37.19 30.57,38.01 C6.2
  Top 0.254: U2.7 46.46,23.24 46.43,23.22 | 49,26.24 49,26.25 R11.1
  Top 0.305: 49,26.24 49,24.23 47.98,23.22 46.43,23.22 | U1.28 36.5,21.39 36.35,21.23 35.66,21.23 35.48,21.06 35.48,20.31 C10.1 | U1.18 31.5,21.54 31.17,21.21 28.8,21.21 28.32,20.73 28.32,20.32 | 28.32,20.32 28.32,19.66 | C7.2 28.31,20.31 28.32,20.32 | U1.12 27.18,26.55 27.18,26.42
  Top 0.406: C8.2 C5.2
  other vias: 33.55,52.25 49.56,4.5
  pour Top (isolate 0.254, rank 2, no thermals): 0,62.28 0.1,43.21 0,37.19 0.03,30.94 0.03,18.29 -0.03,-0.15 56.01,0 55.96,62.28
  pour Bottom (isolate 0.254, rank 2, no thermals): -0.03,59.31 0.03,0.03 55.93,0 55.91,62.2 43.36,62.23 -0.03,62.28
IGNITION
  Top 0.254: R1.1 27.79,37.39 27.79,38.35 26.04,40.11 22.33,40.11 10.97,51.46 J4.4
LEDG  (via drill 0.8)
  Top 0.305: v27.48,23.65 29.64,23.65 30.48,24.49 36.7,24.49 37.49,23.7 U1.30
  Bottom 0.305: v27.48,23.65 18.57,23.65 14.91,27.3 R9.2
LEDR  (via drill 0.8)
  Top 0.305: U1.29 37,23.43 36.5,23.93 30.91,23.93 29.03,22.05 v27.48,22.05
  Bottom 0.305: v27.48,22.05 16.79,22.05 13.41,25.43 R10.1
N$1
  Top 0.305: 23.52,31.5 Y1.P$1 23.02,31.42 | U1.5 26.77,30.05 25.15,31.67 22.76,31.67
  Top 0.813: Y1.P$1 22.76,31.67 20.31,31.67 C1.1
N$3
  Top 0.305: U1.6 26.75,29.55 25.17,27.96 23.35,27.96 Y1.P$2
  Top 0.813: C2.1 20.36,27.97 23.35,27.97 23.35,27.96
N$5  (via drill 0.8)
  Top 0.305: U1.45 41.87,30.55 42.8,29.62 42.8,22.45 52.81,12.45 v52.81,11.86
  Bottom 0.305: v52.81,11.86 52.81,7.75 52.4,7.34 51.42,7.34 R4.1
N$6
  Top 0.813: Q1.3 43.88,59.87 48.06,59.87 J2.2
N$7
  Top 0.305: 43.45,55.59 R7.2 43.38,55.65 43.38,56.54 42.92,57.01 Q1.1
  Top 0.813: 43.45,55.59 45.26,55.59 R8.1
N$8
  Bottom 0.305: R5.1 8.1,29.48 SW1.A'
N$12
  Bottom 0.254: R10.2
  Bottom 0.406: LED2.C 7.04,24.26 6.65,24.64 R10.2
N$13
  Bottom 0.305: 5.6,27.33 R9.1
  Bottom 0.406: LED1.C 4.32,26.77 4.85,27.3 R9.1
N$14
  Bottom 0.305: R6.2 SW1.B'
N$24  (via drill 0.8)
  Top 0.61: R11.2 48.97,31.32 46.66,33.63 v45.54,33.63
  Bottom 0.813: U2.4 27.41,40.46 28.57,39.29 39.88,39.29 v45.54,33.63
N$29
  Top 0.61: C17.1 50.53,37.41 U4.4
N$35  (via drill 0.8)
  Top 0.305: U1.44 41.56,30.05 42.24,29.36 42.24,22.12 51.23,13.13 v51.23,11.86
  Bottom 0.305: 51.46,9.37 R3.1 51.23,9.45 v51.23,11.86
RAD_CANH
  Top 0.203: U3.13 35.31,48.18 33.78,49.71 22.25,49.71 19.84,47.29 16.69,47.29 14.03,49.95 J4.7
RAD_CANL
  Top 0.203: U3.12 36.58,48.46 34.54,50.49 21.84,50.49 19.41,48.06 17.12,48.06 15.05,50.12 J4.8
UART_RX
  Top 0.254: U1.52 37,35.29 37.29,35.59 41.66,35.59 43.26,37.19 43.26,51.33 39.24,55.35 35.94,55.35 J1.4
UART_TX
  Top 0.254: U1.51 37.5,34.96 37.67,35.13 41.96,35.13 43.81,36.98 43.81,51.79 39.75,55.85 37.97,55.85 J1.5
USB_D+
  Bottom 0.305: R4.2 49.69,7.31 J3.3
USB_D-
  Bottom 0.305: R3.2 J3.2
VCAP1
  Top 0.305: U1.31 38,21.67 37.25,20.92 37.25,20.61 37.2,20.56 C10.2
VCAP2
  Top 0.305: U1.47 42.19,31.55 43.56,30.18 43.56,27.28 43.92,26.92 C9.1
VOLT_S  (via drill 0.8)
  Top 0.305: U1.10 27.17,27.55 v26.9,27.81 | 16.82,35.7 R13.2 16.8,33.69 v16.82,33.68
  Top 0.813: R12.1 16.78,35.74 R13.2
  Bottom 0.305: v26.9,27.81 25.17,27.81 24.36,27 19.66,27 16.82,29.85 v16.82,33.68

### Text on the board
bPlace: neo rev a | GND